# Altium schematic sheet 自锁降压模块.SchDoc
size A4; SheetNumber: 1; SheetTotal: 1
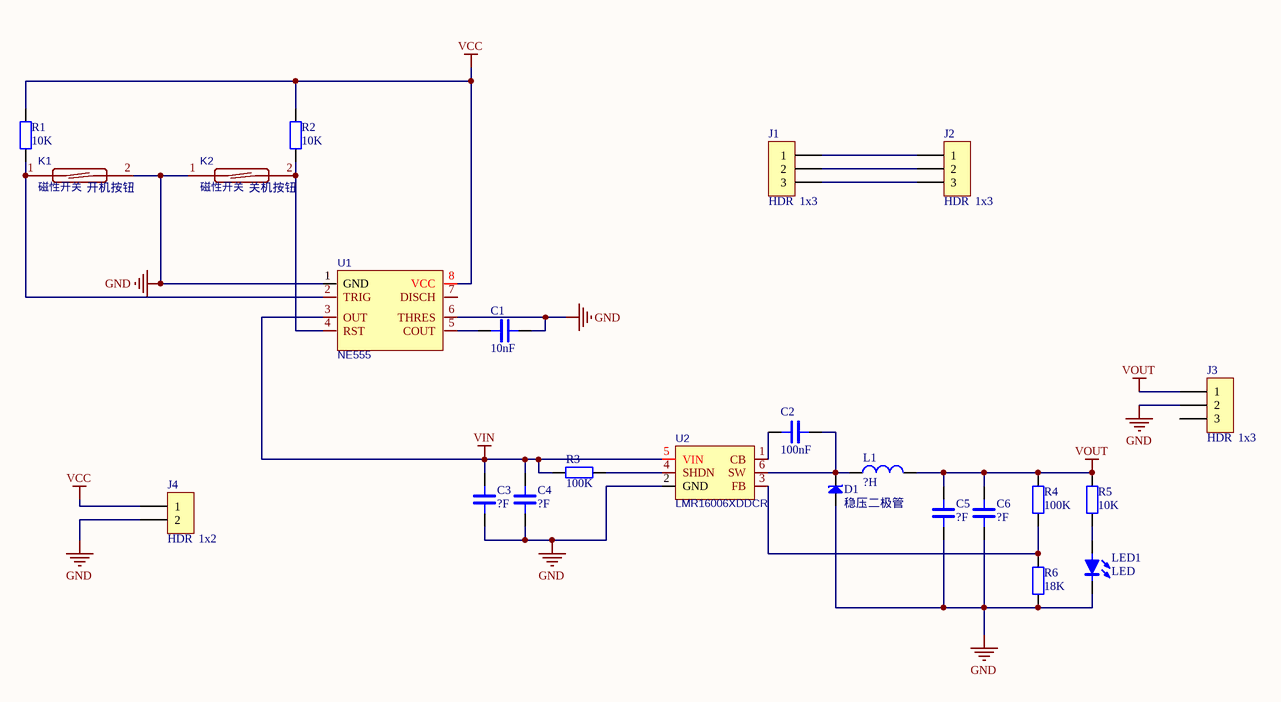
[diagram p0: 自锁降压模块.SchDoc]

## Parts
C1  10nF  [0603_C]
C2  100nF  [0603_C]
C3  ?F  [1206_C]
C4  ?F  [1206_C]
C5  ?F  [1206_C]
C6  ?F  [1206_C]
D1  稳压二极管  [SOD-323]
J1  HDR  1x3  [排针排母 3P 2.54mm]
J2  HDR  1x3  [排针排母 3P 2.54mm]
J3  HDR  1x3  [排针排母 3P 2.54mm]
J4  HDR  1x2  [排针排母 2P 2.54mm]
K1  磁性开关  [MKA14103]
K2  磁性开关  [MKA14103]
L1  ?H  [SMD_7*7*4MM]
LED1  LED  [LED_0603]
R1  10K  [0603_R]
R2  10K  [0603_R]
R3  100K  [0603_R]
R4  100K  [0603_R]
R5  10K  [0603_R]
R6  18K  [0603_R]
U1  NE555  [SOP8]
U2  LMR16006XDDCR  [SOT-23-6]

## Nets
GND: C1.2 C3.1 C4.1 C5.1 C6.1 D1.1(A) J3.2 J4.2 K1.2 K2.1 LED1.2(C) R6.1 U1.1(GND) U1.6(THRES) U2.2(GND)
VCC: J4.1 R1.2 R2.2 U1.8(VCC)
VIN: C3.2 C4.2 R3.2 U1.3(OUT) U2.5(VIN)
VOUT: C5.2 C6.2 J3.1 L1.2 R4.2 R5.2
NetC1_1: C1.1 U1.5(COUT)
NetC2_1: C2.1 U2.1(CB)
NetC2_2: C2.2 D1.2(K) L1.1 U2.6(SW)
NetJ1_1: J1.1 J2.1
NetJ1_2: J1.2 J2.2
NetJ1_3: J1.3 J2.3
NetK1_1: K1.1 R1.1 U1.2(TRIG)
NetK2_2: K2.2 R2.1 U1.4(RST)
NetLED1_1: LED1.1(A) R5.1
NetR3_1: R3.1 U2.4(SHDN)
NetR4_1: R4.1 R6.2 U2.3(FB)

Not connected (* = marked no-connect by the designer): J3 3; U1 7(DISCH)

## Notes on the sheet
- (near K1) 开机按钮
- (near K2) 关机按钮

## Library data of the parts
C1-C6 = CAP: Capacitor
J1-J3 = HDR  1x3: Connector
J4 = HDR  1x2: Connector
K1 K2 = 干簧管: 开关; BOM_Manufacturer: STANDEXMEDER; BOM_Manufacturer Part: KSK-SME560-1015; Contributor: LCSC; BOM_Supplier: LCSC; BOM_Supplier Part: C575284; BOM_JLCPCB Part Class: Extended Part; spicePre: K; spiceSymbolName: KSK-SME560-1015
L1 = Inductor: Code_IEC: 1005; Published: 8-Jun-2000; LatestRevisionDate: 17-Jul-2002; LatestRevisionNote: Re-released for DXP Platform.; PackageReference: 0402-A; Publisher: Altium Limited; Code_JEITA: 0402
R1-R6 = RES: Resistor
U1 = NE555: NE555（世上最牛逼的芯片）; BOM_Manufacturer: TI; BOM_Manufacturer Part: NE555P; Frequency: 100kHz; BOM_Supplier: LCSC; BOM_Supplier Part: C46749; BOM_JLCPCB Part Class: Extended Part; spicePre: U; spiceSymbolName: NE555P
U2 = LMR16006XDDCR: DC-DC降压模块; BOM_Manufacturer: TI; BOM_Supplier: LCSC; BOM_Manufacturer Part: LMR16006XDDCR; BOM_Supplier Part: C87080; BOM_JLCPCB Part Class: Extended Part; spicePre: U; spiceSymbolName: LMR16006XDDCR